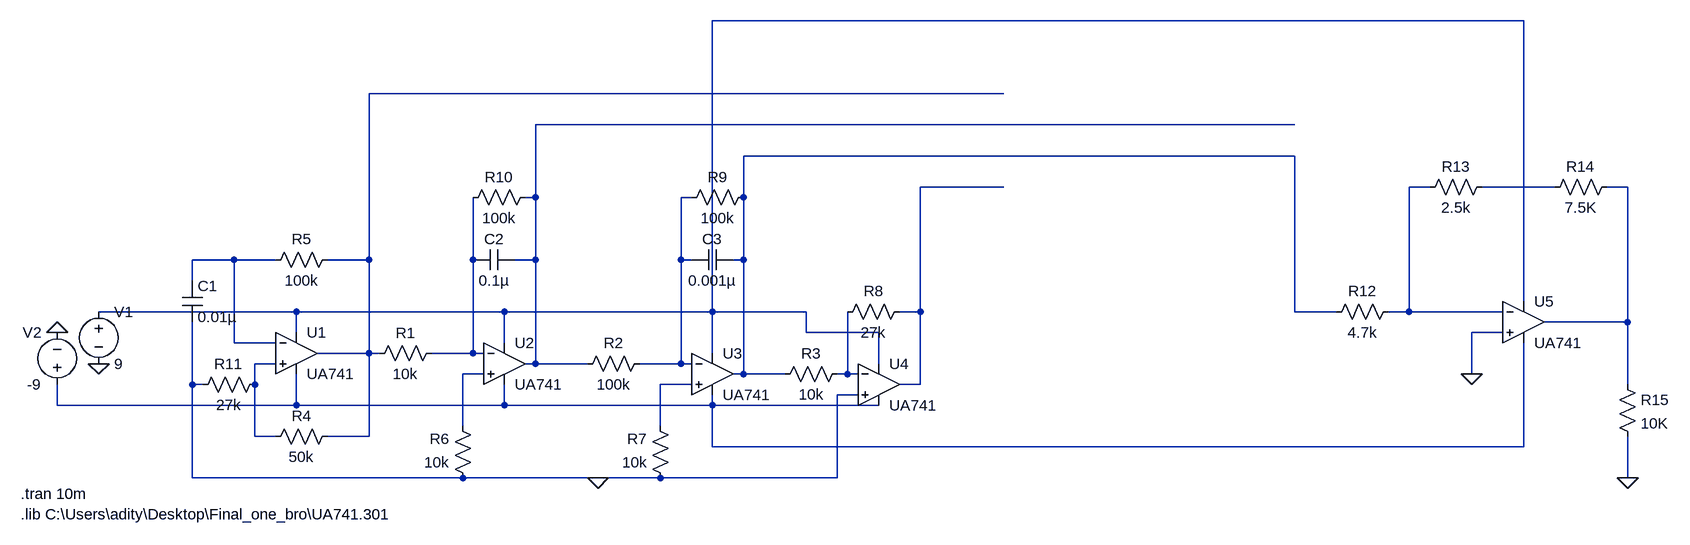
[diagram p0: schematic Initial_ckt.asc]
Initial_ckt.asc, the LTspice schematic file:
Version 4
SHEET 1 2164 680
WIRE 1936 -416 688 -416
WIRE 1136 -304 160 -304
WIRE 1584 -256 416 -256
WIRE 1584 -208 736 -208
WIRE 1136 -160 1008 -160
WIRE 1792 -160 1760 -160
WIRE 1984 -160 1872 -160
WIRE 2096 -160 2064 -160
WIRE 416 -144 416 -256
WIRE 416 -144 400 -144
WIRE 656 -144 640 -144
WIRE 736 -144 736 -208
WIRE -48 -48 -112 -48
WIRE 16 -48 -48 -48
WIRE 160 -48 160 -304
WIRE 160 -48 96 -48
WIRE 320 -48 320 -144
WIRE 416 -48 416 -144
WIRE 416 -48 384 -48
WIRE 640 -48 640 -144
WIRE 656 -48 640 -48
WIRE 736 -48 736 -144
WIRE 736 -48 720 -48
WIRE -112 -16 -112 -48
WIRE 1936 16 1936 -416
WIRE 48 32 -256 32
WIRE 368 32 48 32
WIRE 688 32 688 -416
WIRE 688 32 368 32
WIRE 832 32 688 32
WIRE 1008 32 1008 -160
WIRE 1008 32 976 32
WIRE 1584 32 1584 -208
WIRE 1648 32 1584 32
WIRE 1760 32 1760 -160
WIRE 1760 32 1728 32
WIRE 1904 32 1760 32
WIRE 2096 48 2096 -160
WIRE 2096 48 1968 48
WIRE 48 64 48 32
WIRE 832 64 832 32
WIRE 944 64 832 64
WIRE 1904 64 1856 64
WIRE -48 80 -48 -48
WIRE 16 80 -48 80
WIRE 368 80 368 32
WIRE 160 96 160 -48
WIRE 160 96 80 96
WIRE 176 96 160 96
WIRE 320 96 320 -48
WIRE 320 96 256 96
WIRE 336 96 320 96
WIRE 688 96 688 32
WIRE 16 112 -16 112
WIRE 416 112 416 -48
WIRE 416 112 400 112
WIRE 496 112 416 112
WIRE 640 112 640 -48
WIRE 640 112 576 112
WIRE 656 112 640 112
WIRE 944 112 944 64
WIRE 336 128 304 128
WIRE 736 128 736 -48
WIRE 736 128 720 128
WIRE 800 128 736 128
WIRE 896 128 896 32
WIRE 896 128 880 128
WIRE 912 128 896 128
WIRE 1856 128 1856 64
WIRE -112 144 -112 48
WIRE -96 144 -112 144
WIRE -16 144 -16 112
WIRE 656 144 608 144
WIRE 1008 144 1008 32
WIRE 1008 144 976 144
WIRE 2096 144 2096 48
WIRE 912 160 880 160
WIRE -320 176 -320 144
WIRE 48 176 48 128
WIRE 48 176 -320 176
WIRE 368 176 368 144
WIRE 368 176 48 176
WIRE 688 176 688 160
WIRE 688 176 368 176
WIRE 944 176 688 176
WIRE 304 208 304 128
WIRE 608 208 608 144
WIRE -16 224 -16 144
WIRE 16 224 -16 224
WIRE 160 224 160 96
WIRE 160 224 96 224
WIRE 688 240 688 176
WIRE 1936 240 1936 80
WIRE 1936 240 688 240
WIRE -112 288 -112 144
WIRE 304 288 -112 288
WIRE 512 288 304 288
WIRE 608 288 512 288
WIRE 880 288 880 160
WIRE 880 288 608 288
WIRE 2096 288 2096 224
FLAG 512 288 0
FLAG -256 112 0
FLAG -320 64 0
FLAG 1856 128 0
FLAG 2096 288 0
SYMBOL OpAmps\\opamp2 48 32 R0
SYMATTR InstName U1
SYMATTR Value UA741
SYMBOL OpAmps\\opamp2 368 48 R0
SYMATTR InstName U2
SYMATTR Value UA741
SYMBOL OpAmps\\opamp2 688 64 R0
SYMATTR InstName U3
SYMATTR Value UA741
SYMBOL OpAmps\\opamp2 944 80 R0
SYMATTR InstName U4
SYMATTR Value UA741
SYMBOL res 272 80 R90
WINDOW 0 0 56 VBottom 2
WINDOW 3 32 56 VTop 2
SYMATTR InstName R1
SYMATTR Value 10k
SYMBOL res 592 96 R90
WINDOW 0 0 56 VBottom 2
WINDOW 3 32 56 VTop 2
SYMATTR InstName R2
SYMATTR Value 100k
SYMBOL res 896 112 R90
WINDOW 0 0 56 VBottom 2
WINDOW 3 32 56 VTop 2
SYMATTR InstName R3
SYMATTR Value 10k
SYMBOL res 112 208 R90
WINDOW 0 0 56 VBottom 2
WINDOW 3 32 56 VTop 2
SYMATTR InstName R4
SYMATTR Value 50k
SYMBOL res 112 -64 R90
WINDOW 0 0 56 VBottom 2
WINDOW 3 32 56 VTop 2
SYMATTR InstName R5
SYMATTR Value 100k
SYMBOL res 320 304 R180
WINDOW 0 36 76 Left 2
WINDOW 3 36 40 Left 2
SYMATTR InstName R6
SYMATTR Value 10k
SYMBOL res 624 304 R180
WINDOW 0 36 76 Left 2
WINDOW 3 36 40 Left 2
SYMATTR InstName R7
SYMATTR Value 10k
SYMBOL res 880 48 R270
WINDOW 0 32 56 VTop 2
WINDOW 3 0 56 VBottom 2
SYMATTR InstName R8
SYMATTR Value 27k
SYMBOL res 640 -128 R270
WINDOW 0 32 56 VTop 2
WINDOW 3 0 56 VBottom 2
SYMATTR InstName R9
SYMATTR Value 100k
SYMBOL res 304 -128 R270
WINDOW 0 32 56 VTop 2
WINDOW 3 0 56 VBottom 2
SYMATTR InstName R10
SYMATTR Value 100k
SYMBOL cap -128 -16 R0
SYMATTR InstName C1
SYMATTR Value 0.01µ
SYMBOL cap 384 -64 R90
WINDOW 0 0 32 VBottom 2
WINDOW 3 32 32 VTop 2
SYMATTR InstName C2
SYMATTR Value 0.1µ
SYMBOL cap 720 -64 R90
WINDOW 0 0 32 VBottom 2
WINDOW 3 32 32 VTop 2
SYMATTR InstName C3
SYMATTR Value 0.001µ
SYMBOL res 0 128 R90
WINDOW 0 0 56 VBottom 2
WINDOW 3 32 56 VTop 2
SYMATTR InstName R11
SYMATTR Value 27k
SYMBOL voltage -256 16 R0
WINDOW 123 0 0 Left 0
WINDOW 39 0 0 Left 0
SYMATTR InstName V1
SYMATTR Value 9
SYMBOL voltage -320 160 R180
WINDOW 0 24 96 Left 2
WINDOW 3 24 16 Left 2
WINDOW 123 0 0 Left 0
WINDOW 39 0 0 Left 0
SYMATTR InstName V2
SYMATTR Value -9
SYMBOL OpAmps\\opamp2 1936 -16 R0
SYMATTR InstName U5
SYMATTR Value UA741
SYMBOL res 1744 16 R90
WINDOW 0 0 56 VBottom 2
WINDOW 3 32 56 VTop 2
SYMATTR InstName R12
SYMATTR Value 4.7k
SYMBOL res 1888 -176 R90
WINDOW 0 0 56 VBottom 2
WINDOW 3 32 56 VTop 2
SYMATTR InstName R13
SYMATTR Value 2.5k
SYMBOL res 2080 -176 R90
WINDOW 0 0 56 VBottom 2
WINDOW 3 32 56 VTop 2
SYMATTR InstName R14
SYMATTR Value 7.5K
SYMBOL res 2080 128 R0
SYMATTR InstName R15
SYMATTR Value 10K
TEXT -376 312 Left 2 !.tran 10m
TEXT -376 344 Left 2 !.lib C:\\Users\\adity\\Desktop\\Final_one_bro\\UA741.301

The netlist it stands for:
* Initial_ckt.asc
XU1 N012 N010 N001 N016 N002 UA741  ; pins In+ In- V+ V- OUT
XU2 N013 N011 N001 N016 N003 UA741  ; pins In+ In- V+ V- OUT
XU3 N015 N009 N001 N016 N004 UA741  ; pins In+ In- V+ V- OUT
XU4 0 N014 N001 N016 N005 UA741  ; pins In+ In- V+ V- OUT
R1 N011 N002 10k
R2 N009 N003 100k
R3 N014 N004 10k
R4 N002 N012 50k
R5 N002 N010 100k
R6 0 N013 10k
R7 0 N015 10k
R8 N014 N005 27k
R9 N009 N004 100k
R10 N011 N003 100k
C1 N010 0 0.01µ
C2 N003 N011 0.1µ
C3 N004 N009 0.001µ
R11 N012 0 27k
V1 N001 0 9
V2 N016 0 -9
XU5 0 N006 N001 N016 N008 UA741  ; pins In+ In- V+ V- OUT
R12 N006 N004 4.7k
R13 N007 N006 2.5k
R14 N008 N007 7.5K
R15 N008 0 10K
.tran 10m
.lib C:\Users\adity\Desktop\Final_one_bro\UA741.301
.backanno
.end